# Altium schematic sheet p6_led_matrix.SchDoc
size A1; SheetNumber: 6; SheetTotal: 8; Organization: Mig Trading LCC; Address1: B. Sadovaya st. 239/614; Address2: Saratov; Address3: RU; Address4: mig-trading.ru
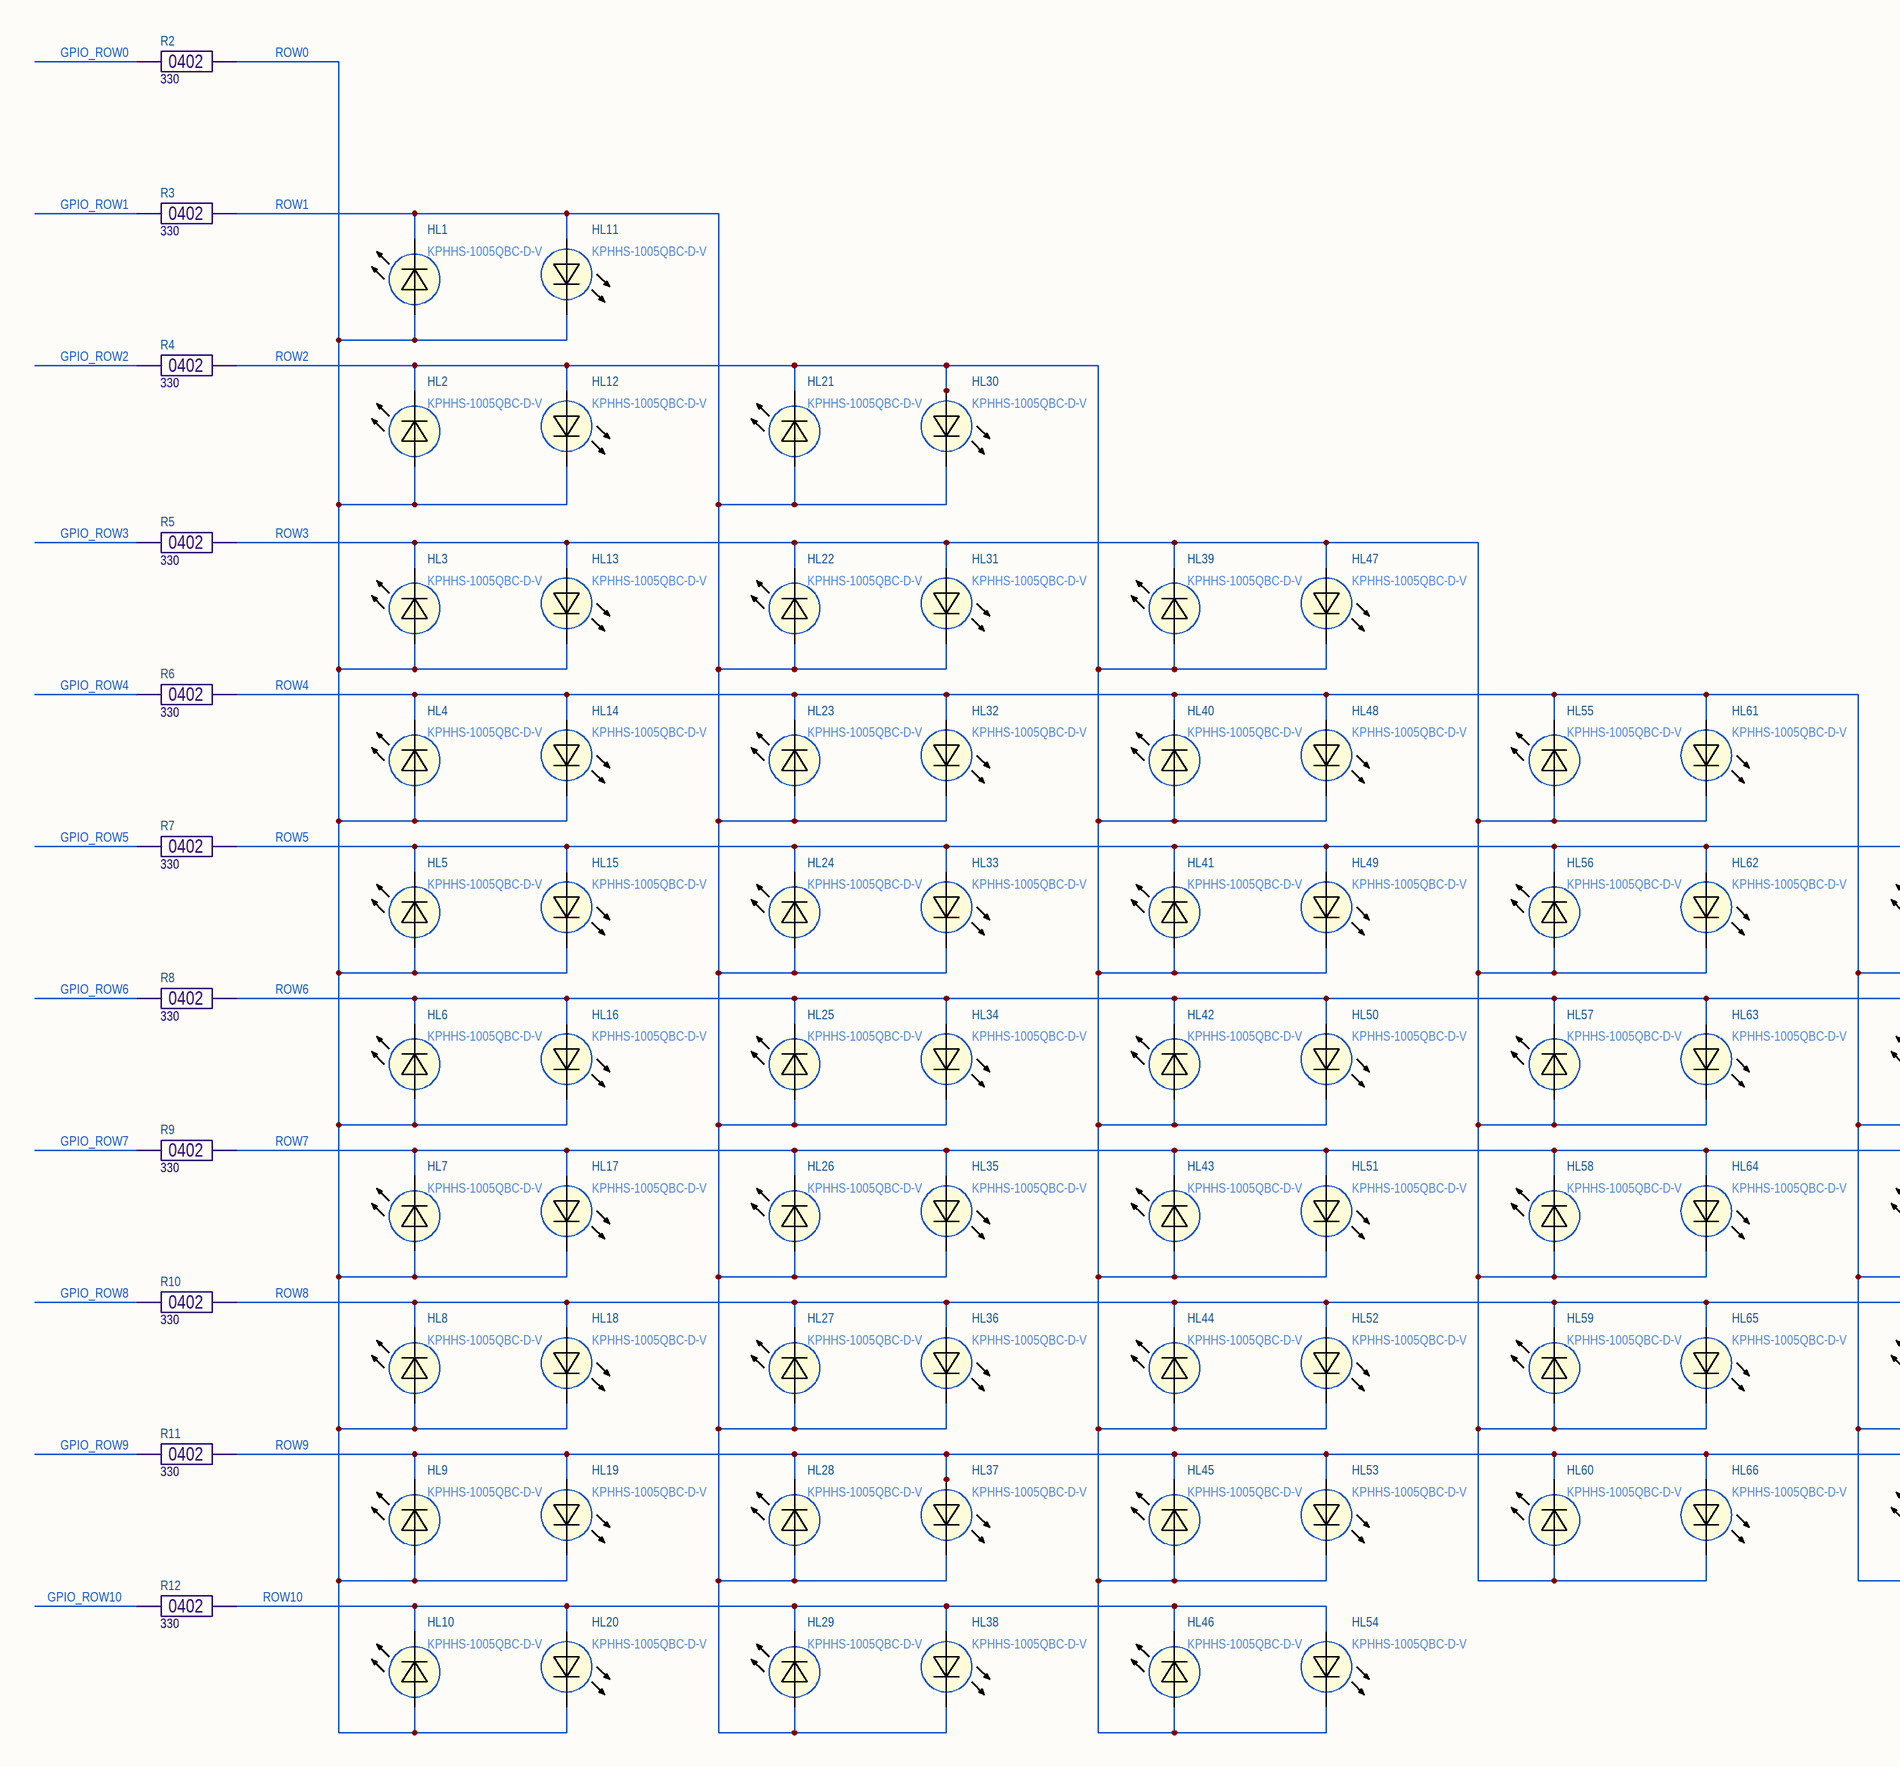
[diagram p0: p6_led_matrix.SchDoc, left]
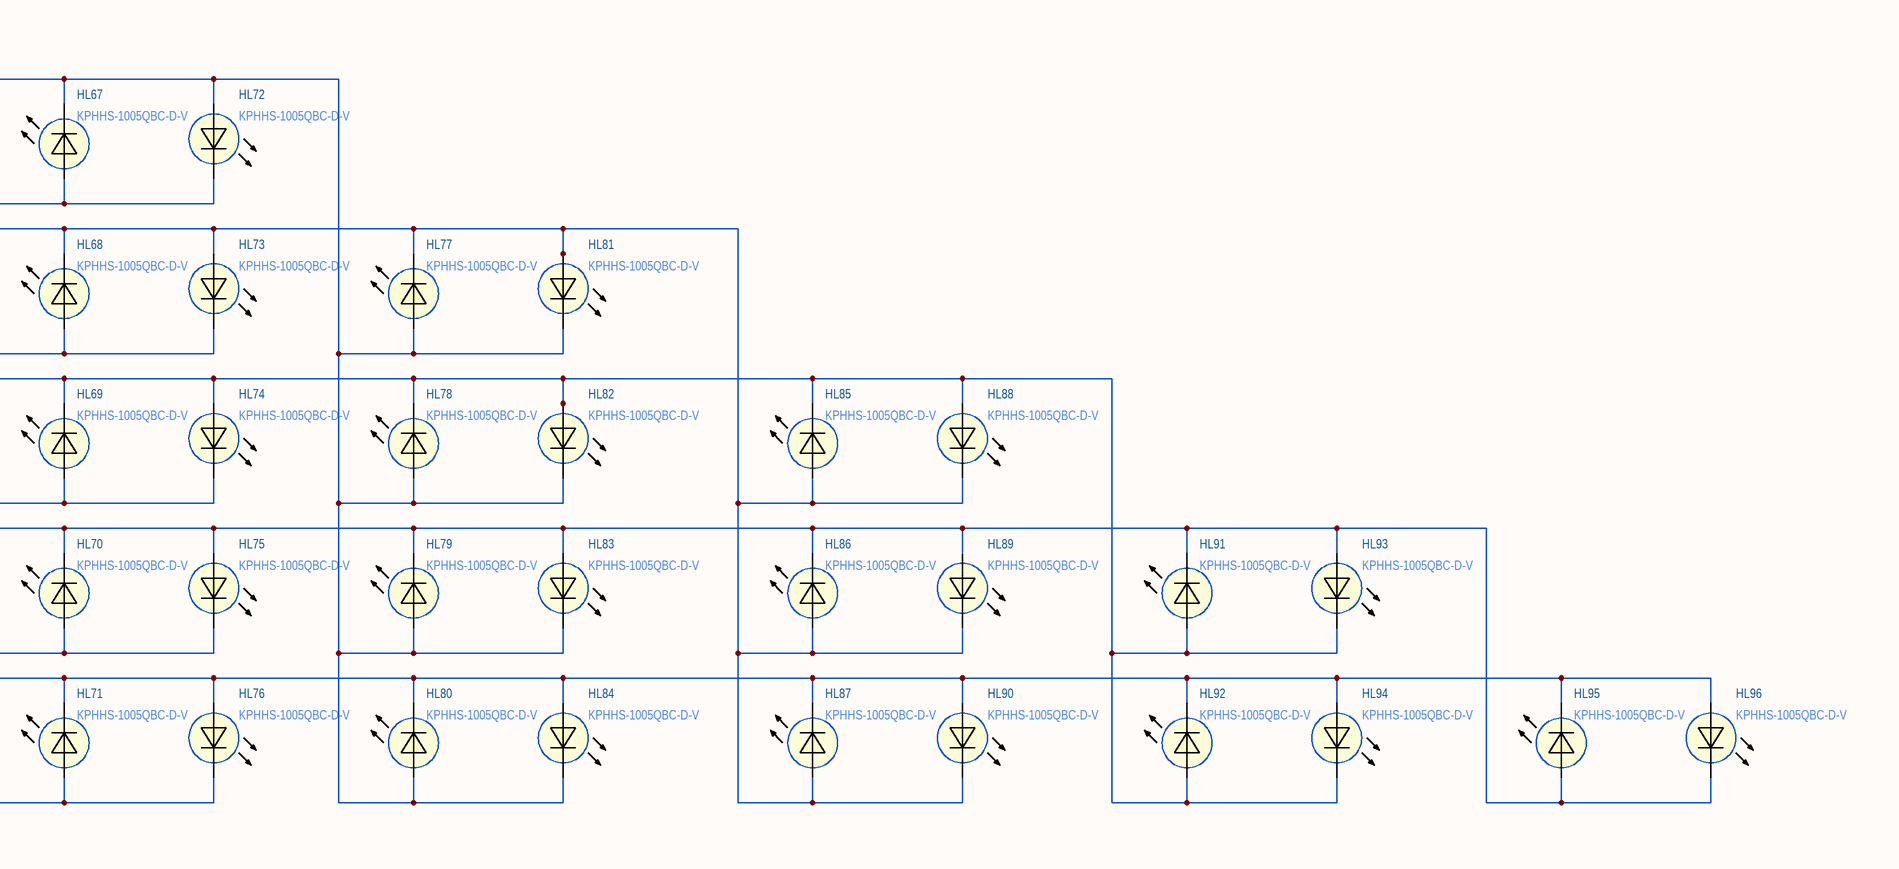
[diagram p1: p6_led_matrix.SchDoc, right]

## Parts
HL1  KPHHS-1005QBC-D-V  [LED0402B]
HL2  KPHHS-1005QBC-D-V  [LED0402B]
HL3  KPHHS-1005QBC-D-V  [LED0402B]
HL4  KPHHS-1005QBC-D-V  [LED0402B]
HL5  KPHHS-1005QBC-D-V  [LED0402B]
HL6  KPHHS-1005QBC-D-V  [LED0402B]
HL7  KPHHS-1005QBC-D-V  [LED0402B]
HL8  KPHHS-1005QBC-D-V  [LED0402B]
HL9  KPHHS-1005QBC-D-V  [LED0402B]
HL10  KPHHS-1005QBC-D-V  [LED0402B]
HL11  KPHHS-1005QBC-D-V  [LED0402B]
HL12  KPHHS-1005QBC-D-V  [LED0402B]
HL13  KPHHS-1005QBC-D-V  [LED0402B]
HL14  KPHHS-1005QBC-D-V  [LED0402B]
HL15  KPHHS-1005QBC-D-V  [LED0402B]
HL16  KPHHS-1005QBC-D-V  [LED0402B]
HL17  KPHHS-1005QBC-D-V  [LED0402B]
HL18  KPHHS-1005QBC-D-V  [LED0402B]
HL19  KPHHS-1005QBC-D-V  [LED0402B]
HL20  KPHHS-1005QBC-D-V  [LED0402B]
HL21  KPHHS-1005QBC-D-V  [LED0402B]
HL22  KPHHS-1005QBC-D-V  [LED0402B]
HL23  KPHHS-1005QBC-D-V  [LED0402B]
HL24  KPHHS-1005QBC-D-V  [LED0402B]
HL25  KPHHS-1005QBC-D-V  [LED0402B]
HL26  KPHHS-1005QBC-D-V  [LED0402B]
HL27  KPHHS-1005QBC-D-V  [LED0402B]
HL28  KPHHS-1005QBC-D-V  [LED0402B]
HL29  KPHHS-1005QBC-D-V  [LED0402B]
HL30  KPHHS-1005QBC-D-V  [LED0402B]
HL31  KPHHS-1005QBC-D-V  [LED0402B]
HL32  KPHHS-1005QBC-D-V  [LED0402B]
HL33  KPHHS-1005QBC-D-V  [LED0402B]
HL34  KPHHS-1005QBC-D-V  [LED0402B]
HL35  KPHHS-1005QBC-D-V  [LED0402B]
HL36  KPHHS-1005QBC-D-V  [LED0402B]
HL37  KPHHS-1005QBC-D-V  [LED0402B]
HL38  KPHHS-1005QBC-D-V  [LED0402B]
HL39  KPHHS-1005QBC-D-V  [LED0402B]
HL40  KPHHS-1005QBC-D-V  [LED0402B]
HL41  KPHHS-1005QBC-D-V  [LED0402B]
HL42  KPHHS-1005QBC-D-V  [LED0402B]
HL43  KPHHS-1005QBC-D-V  [LED0402B]
HL44  KPHHS-1005QBC-D-V  [LED0402B]
HL45  KPHHS-1005QBC-D-V  [LED0402B]
HL46  KPHHS-1005QBC-D-V  [LED0402B]
HL47  KPHHS-1005QBC-D-V  [LED0402B]
HL48  KPHHS-1005QBC-D-V  [LED0402B]
HL49  KPHHS-1005QBC-D-V  [LED0402B]
HL50  KPHHS-1005QBC-D-V  [LED0402B]
HL51  KPHHS-1005QBC-D-V  [LED0402B]
HL52  KPHHS-1005QBC-D-V  [LED0402B]
HL53  KPHHS-1005QBC-D-V  [LED0402B]
HL54  KPHHS-1005QBC-D-V  [LED0402B]
HL55  KPHHS-1005QBC-D-V  [LED0402B]
HL56  KPHHS-1005QBC-D-V  [LED0402B]
HL57  KPHHS-1005QBC-D-V  [LED0402B]
HL58  KPHHS-1005QBC-D-V  [LED0402B]
HL59  KPHHS-1005QBC-D-V  [LED0402B]
HL60  KPHHS-1005QBC-D-V  [LED0402B]
HL61  KPHHS-1005QBC-D-V  [LED0402B]
HL62  KPHHS-1005QBC-D-V  [LED0402B]
HL63  KPHHS-1005QBC-D-V  [LED0402B]
HL64  KPHHS-1005QBC-D-V  [LED0402B]
HL65  KPHHS-1005QBC-D-V  [LED0402B]
HL66  KPHHS-1005QBC-D-V  [LED0402B]
HL67  KPHHS-1005QBC-D-V  [LED0402B]
HL68  KPHHS-1005QBC-D-V  [LED0402B]
HL69  KPHHS-1005QBC-D-V  [LED0402B]
HL70  KPHHS-1005QBC-D-V  [LED0402B]
HL71  KPHHS-1005QBC-D-V  [LED0402B]
HL72  KPHHS-1005QBC-D-V  [LED0402B]
HL73  KPHHS-1005QBC-D-V  [LED0402B]
HL74  KPHHS-1005QBC-D-V  [LED0402B]
HL75  KPHHS-1005QBC-D-V  [LED0402B]
HL76  KPHHS-1005QBC-D-V  [LED0402B]
HL77  KPHHS-1005QBC-D-V  [LED0402B]
HL78  KPHHS-1005QBC-D-V  [LED0402B]
HL79  KPHHS-1005QBC-D-V  [LED0402B]
HL80  KPHHS-1005QBC-D-V  [LED0402B]
HL81  KPHHS-1005QBC-D-V  [LED0402B]
HL82  KPHHS-1005QBC-D-V  [LED0402B]
HL83  KPHHS-1005QBC-D-V  [LED0402B]
HL84  KPHHS-1005QBC-D-V  [LED0402B]
HL85  KPHHS-1005QBC-D-V  [LED0402B]
HL86  KPHHS-1005QBC-D-V  [LED0402B]
HL87  KPHHS-1005QBC-D-V  [LED0402B]
HL88  KPHHS-1005QBC-D-V  [LED0402B]
HL89  KPHHS-1005QBC-D-V  [LED0402B]
HL90  KPHHS-1005QBC-D-V  [LED0402B]
HL91  KPHHS-1005QBC-D-V  [LED0402B]
HL92  KPHHS-1005QBC-D-V  [LED0402B]
HL93  KPHHS-1005QBC-D-V  [LED0402B]
HL94  KPHHS-1005QBC-D-V  [LED0402B]
HL95  KPHHS-1005QBC-D-V  [LED0402B]
HL96  KPHHS-1005QBC-D-V  [LED0402B]
R2  330  Package: 0402  [RES0402B]
R3  330  Package: 0402  [RES0402B]
R4  330  Package: 0402  [RES0402B]
R5  330  Package: 0402  [RES0402B]
R6  330  Package: 0402  [RES0402B]
R7  330  Package: 0402  [RES0402B]
R8  330  Package: 0402  [RES0402B]
R9  330  Package: 0402  [RES0402B]
R10  330  Package: 0402  [RES0402B]
R11  330  Package: 0402  [RES0402B]
R12  330  Package: 0402  [RES0402B]

## Nets
GPIO_ROW0: R2.2
GPIO_ROW1: R3.2
GPIO_ROW2: R4.2
GPIO_ROW3: R5.2
GPIO_ROW4: R6.2
GPIO_ROW5: R7.2
GPIO_ROW6: R8.2
GPIO_ROW7: R9.2
GPIO_ROW8: R10.2
GPIO_ROW9: R11.2
GPIO_ROW10: R12.2
ROW0: HL1.2 HL2.2 HL3.2 HL4.2 HL5.2 HL6.2 HL7.2 HL8.2 HL9.2 HL10.2 HL11.1 HL12.1 HL13.1 HL14.1 HL15.1 HL16.1 HL17.1 HL18.1 HL19.1 HL20.1 R2.1
ROW1: HL1.1 HL11.2 HL21.2 HL22.2 HL23.2 HL24.2 HL25.2 HL26.2 HL27.2 HL28.2 HL29.2 HL30.1 HL31.1 HL32.1 HL33.1 HL34.1 HL35.1 HL36.1 HL37.1 HL38.1 R3.1
ROW2: HL2.1 HL12.2 HL21.1 HL30.2 HL39.2 HL40.2 HL41.2 HL42.2 HL43.2 HL44.2 HL45.2 HL46.2 HL47.1 HL48.1 HL49.1 HL50.1 HL51.1 HL52.1 HL53.1 HL54.1 R4.1
ROW3: HL3.1 HL13.2 HL22.1 HL31.2 HL39.1 HL47.2 HL55.2 HL56.2 HL57.2 HL58.2 HL59.2 HL60.2 HL61.1 HL62.1 HL63.1 HL64.1 HL65.1 HL66.1 R5.1
ROW4: HL4.1 HL14.2 HL23.1 HL32.2 HL40.1 HL48.2 HL55.1 HL61.2 HL67.2 HL68.2 HL69.2 HL70.2 HL71.2 HL72.1 HL73.1 HL74.1 HL75.1 HL76.1 R6.1
ROW5: HL5.1 HL15.2 HL24.1 HL33.2 HL41.1 HL49.2 HL56.1 HL62.2 HL67.1 HL72.2 HL77.2 HL78.2 HL79.2 HL80.2 HL81.1 HL82.1 HL83.1 HL84.1 R7.1
ROW6: HL6.1 HL16.2 HL25.1 HL34.2 HL42.1 HL50.2 HL57.1 HL63.2 HL68.1 HL73.2 HL77.1 HL81.2 HL85.2 HL86.2 HL87.2 HL88.1 HL89.1 HL90.1 R8.1
ROW7: HL7.1 HL17.2 HL26.1 HL35.2 HL43.1 HL51.2 HL58.1 HL64.2 HL69.1 HL74.2 HL78.1 HL82.2 HL85.1 HL88.2 HL91.2 HL92.2 HL93.1 HL94.1 R9.1
ROW8: HL8.1 HL18.2 HL27.1 HL36.2 HL44.1 HL52.2 HL59.1 HL65.2 HL70.1 HL75.2 HL79.1 HL83.2 HL86.1 HL89.2 HL91.1 HL93.2 HL95.2 HL96.1 R10.1
ROW9: HL9.1 HL19.2 HL28.1 HL37.2 HL45.1 HL53.2 HL60.1 HL66.2 HL71.1 HL76.2 HL80.1 HL84.2 HL87.1 HL90.2 HL92.1 HL94.2 HL95.1 HL96.2 R11.1
ROW10: HL10.1 HL20.2 HL29.1 HL38.2 HL46.1 HL54.2 R12.1

## Notes on the sheet
- Size
- Title:
- Date:
- A2
- Sheet
- of
- Revision:

## Library data of the parts
HL1-HL96 = KPHHS-1005QBC-D-V: Blue led (package case 0402); Manufacturer: Kingbright Company LLC.; Designator: HL*; Forward Current: 20 mA; Forward Voltage: 3.3V; Wavelength: 465 nm; Package: 0402; Part Number: KPHHS-1005QBC-D-V; Color: Blue
R2-R12 = R0402: Resistor 0402 package case; Part Number: RC0402FR-07330RL; Manufacturer: Yageo; Tolerance: ± 1 %; Temperature Coefficient: ±100 ppm/K; Value: 330; Value on schem: 330